# Altium schematic sheet 03.SchDoc
size 420 x 297 mm
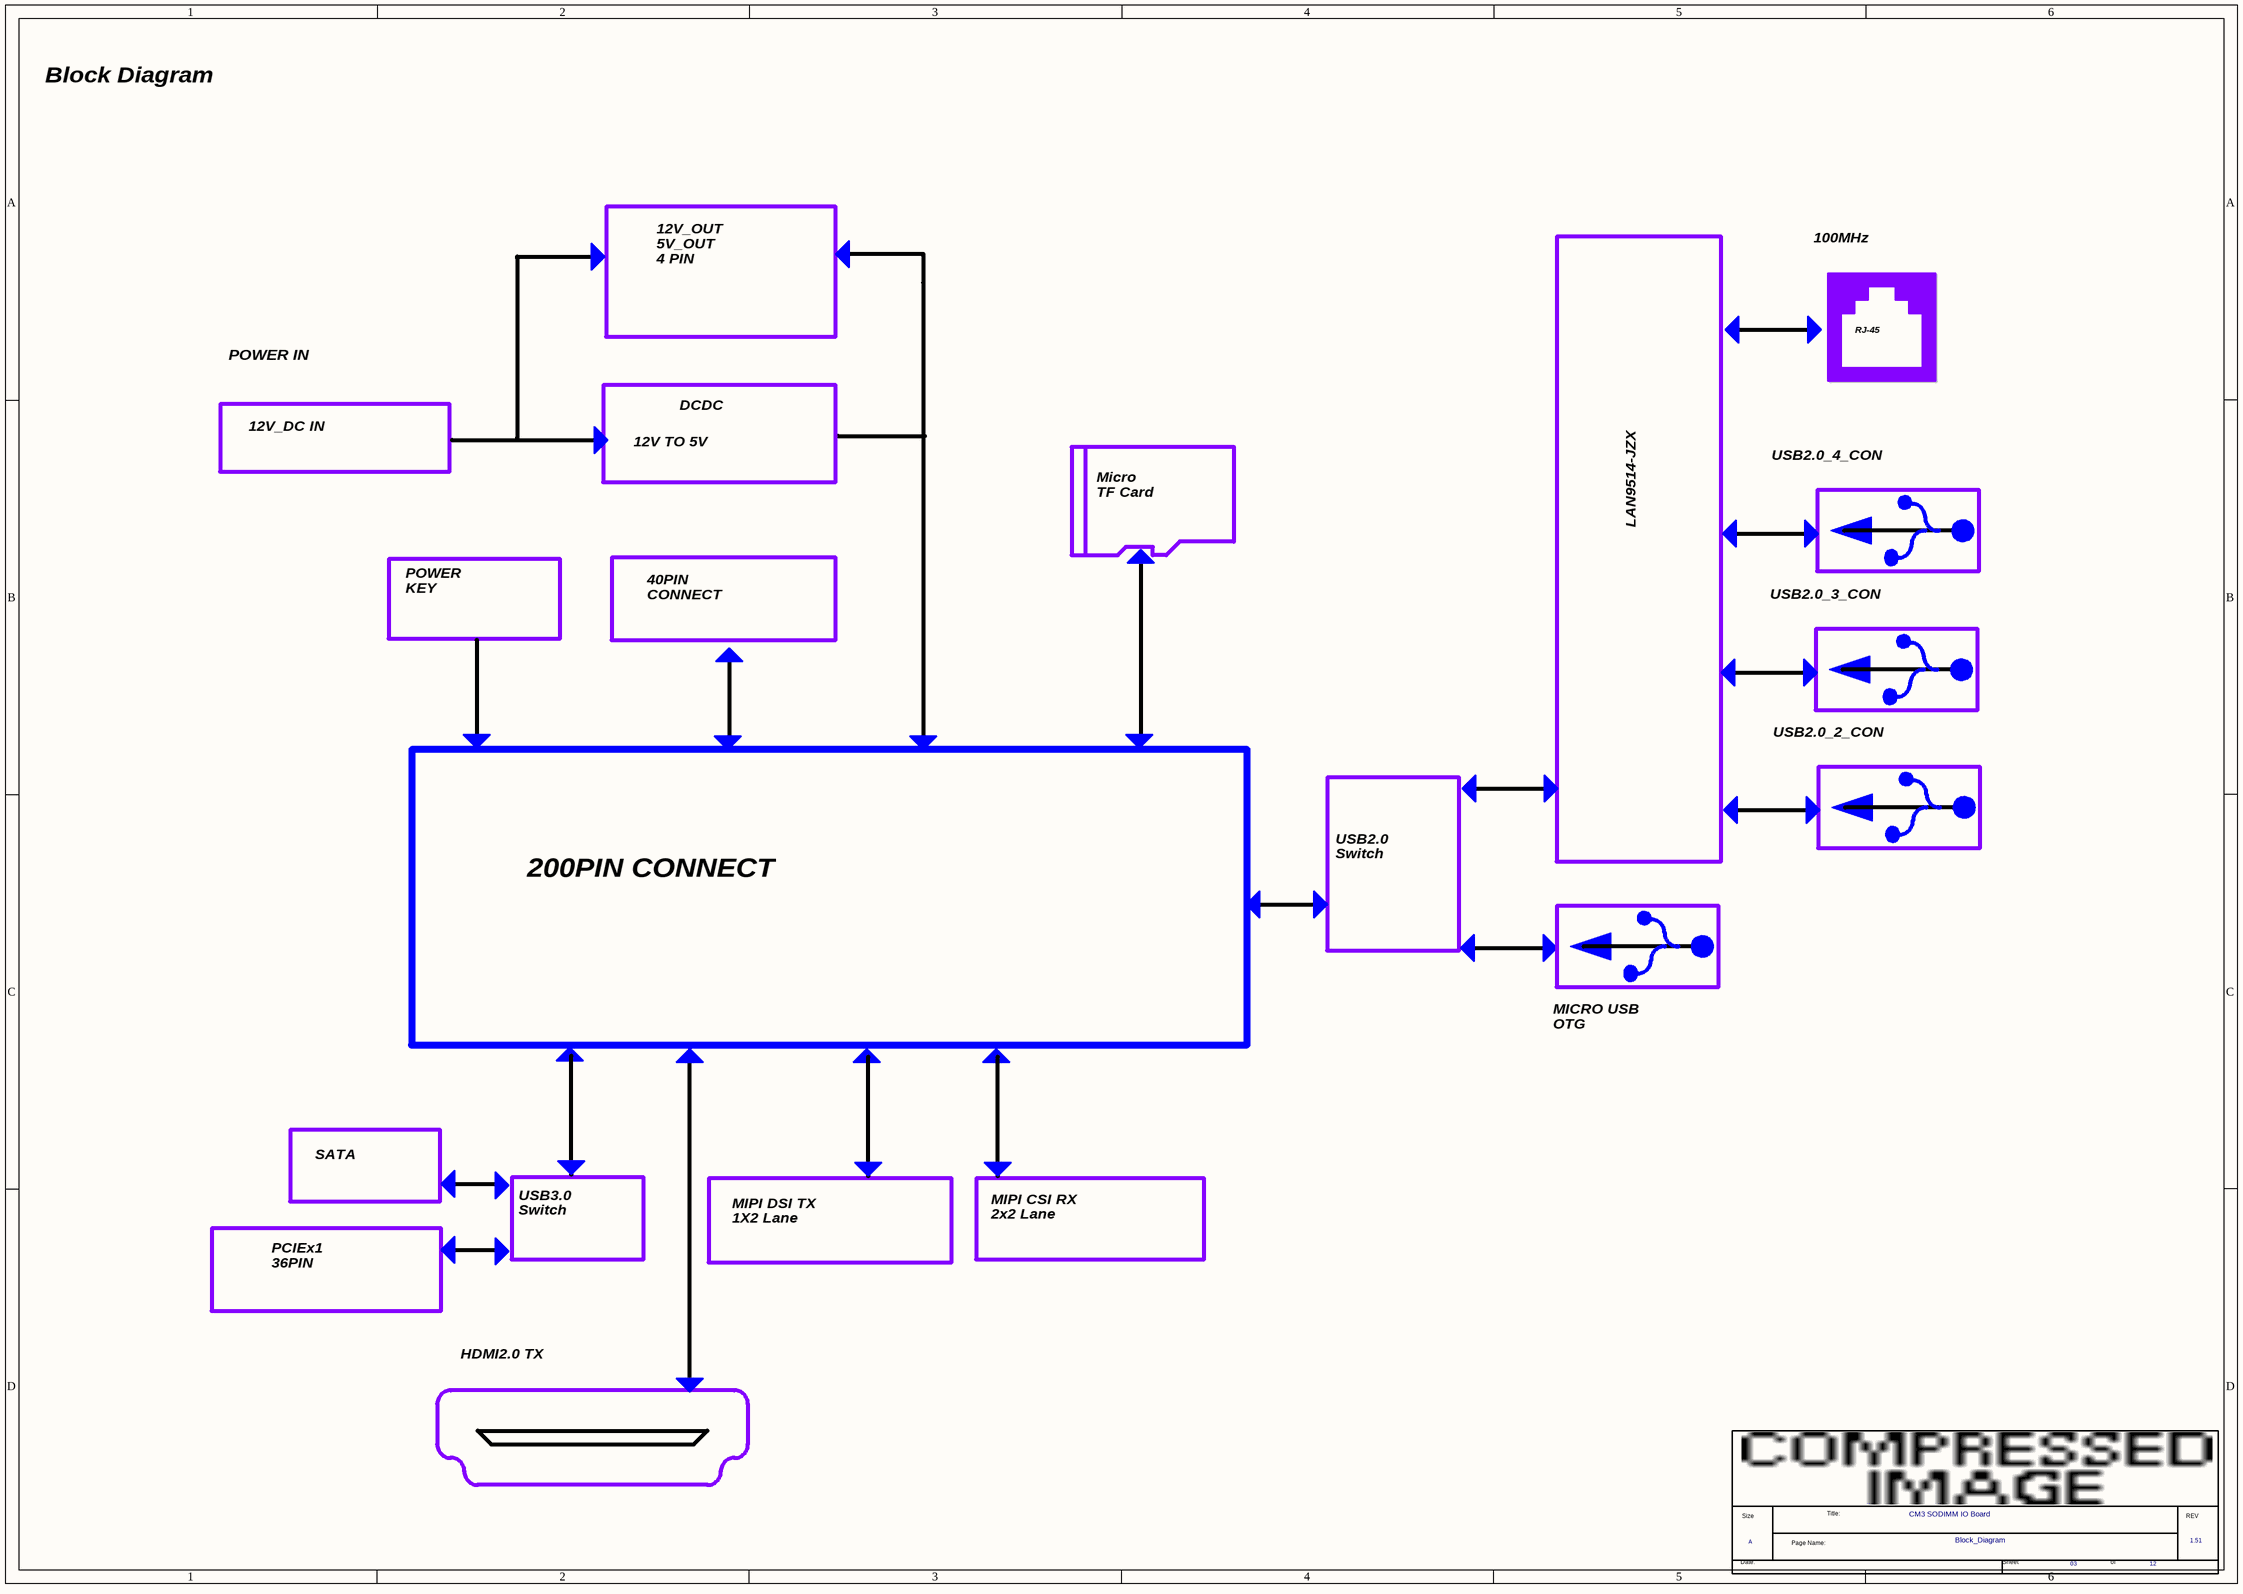
[diagram p0: 03.SchDoc]

## Parts
*  Page Count: 12  Page Number: 03  Page Size: A  Title: CM3 SODIMM IO Board  RevCode: 1.51  Doc: Block_Diagram  (hidden comment: radxa_1010)  (graphical)

## Notes on the sheet
- Block Diagram
- 12V_OUT
  5V_OUT
  4 PIN
- 100MHz
- POWER IN
- RJ-45
- 12V_DC IN
- 12V TO 5V
- DCDC
- Micro
  TF Card
- USB2.0_4_CON
- LAN9514-JZX
- POWER
  KEY
- 40PIN
  CONNECT
- USB2.0_3_CON
- USB2.0_2_CON
- USB2.0
  Switch
- 200PIN CONNECT
- MICRO USB
  OTG
- SATA
- USB3.0
  Switch
- MIPI DSI TX
  1X2 Lane
- MIPI CSI RX
  2x2 Lane
- PCIEx1
  36PIN
- HDMI2.0 TX
- (in symbol radxa_1010) Title:; Size; REV; Page Name:; Date:; Sheet; of

## Library data of the parts
* = radxa_1010: Page Create Date: March  8, 1995